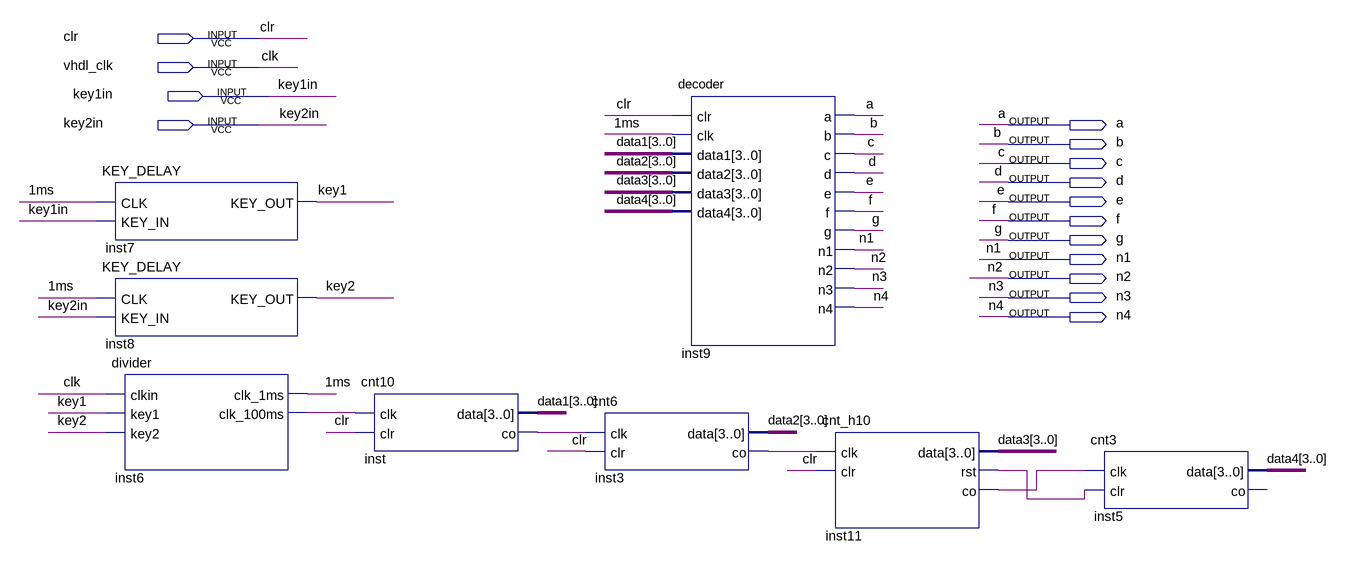
[diagram p0: schematic sheet]
// Quartus schematic clock.bdf as structural Verilog: 8 symbols, 15 pins
module clock (
  input  clr,
  input  vhdl_clk,
  input  key1in,
  input  key2in,
  output a,
  output b,
  output c,
  output d,
  output e,
  output f,
  output g,
  output n1,
  output n2,
  output n3,
  output n4
);

  wire \1ms , inst3_co, inst6_clk_100ms, inst11_co, inst11_rst, inst_co, key1, key2;
  wire [3:0] data1, data2, data3, data4;

  KEY_DELAY inst7 (.CLK(\1ms ), .KEY_IN(key1in), .KEY_OUT(key1));
  KEY_DELAY inst8 (.CLK(\1ms ), .KEY_IN(key2in), .KEY_OUT(key2));
  divider inst6 (.clkin(vhdl_clk), .key1(key1), .key2(key2), .clk_1ms(\1ms ), .clk_100ms(inst6_clk_100ms));
  cnt10 inst (.clk(inst6_clk_100ms), .clr(clr), .data(data1), .co(inst_co));
  cnt6 inst3 (.clk(inst_co), .clr(clr), .data(data2), .co(inst3_co));
  decoder inst9 (
    .clr(clr), .clk(\1ms ), .data1(data1), .data2(data2), .data3(data3), .data4(data4), .a(a), .b(b), .c(c),
    .d(d), .e(e), .f(f), .g(g), .n1(n1), .n2(n2), .n3(n3), .n4(n4));
  cnt_h10 inst11 (.clk(inst3_co), .clr(clr), .data(data3), .rst(inst11_rst), .co(inst11_co));
  cnt3 inst5 (.clk(inst11_co), .clr(inst11_rst), .data(data4));  // open: co

  // Other names for the same wires on the sheet: clk = vhdl_clk
endmodule
